# EAGLE design EEZ AUX PS r5B6a (EAGLE 6.1)
Assembly variants: Farnell, TME

## Sheet 1 of 2
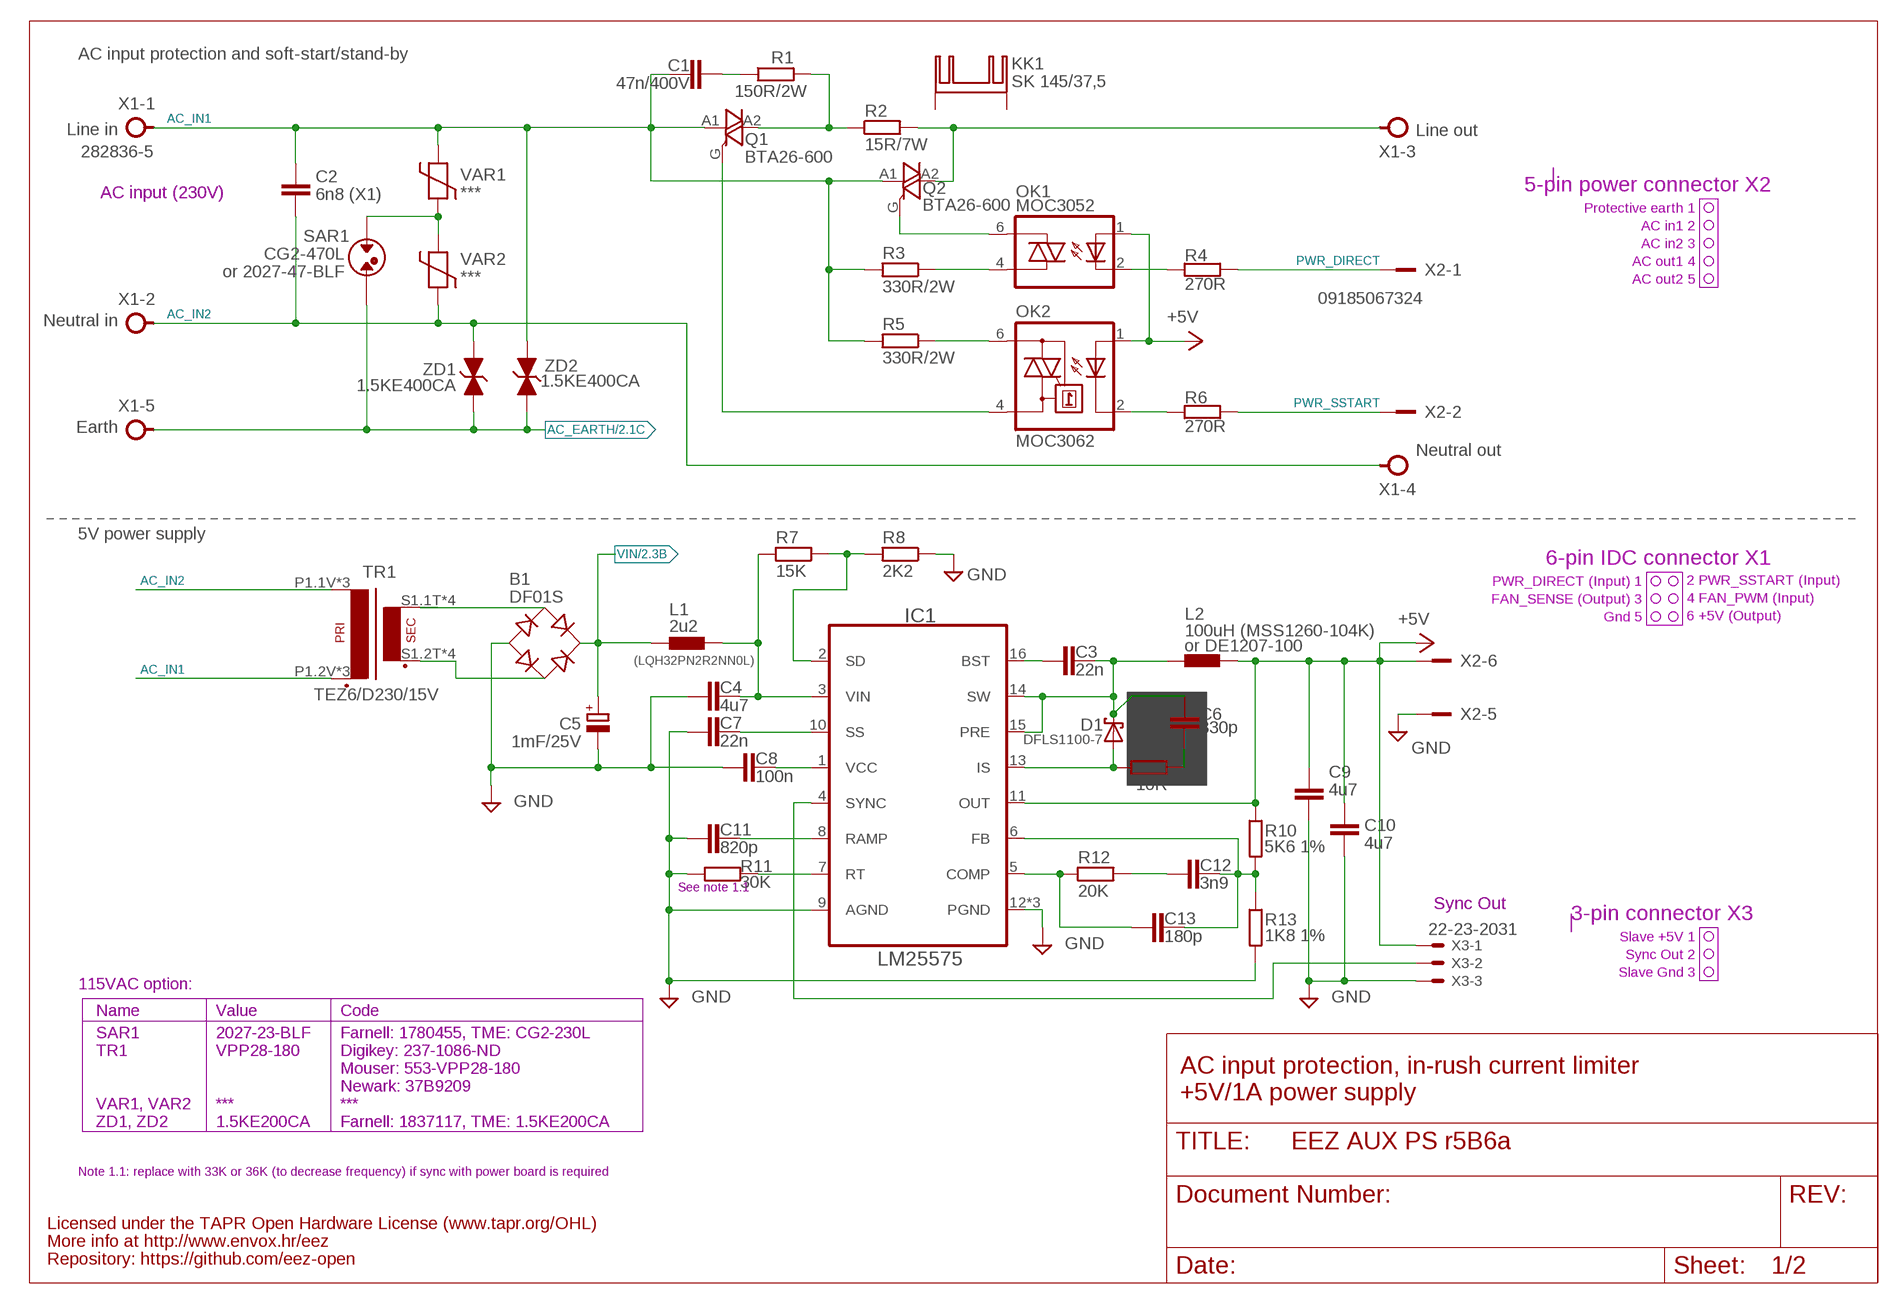
[diagram p0: schematic, sheet 1]

### Parts
B1  DF01S  [DFS]
C1  47n/400V  C-EU075-052X106  [C075-052X106]
C2  6n8 (X1)  C-EU102-064X133  [C102-064X133]
C3  22n  C-EUC0805  [C0805]
C4  4u7  C-EUC1210  [C1210]
C5  1mF/25V  ECAP5G_10.5MM  [ECAP5/10.5]
C6  330p  C-EUC0805  [C0805]
C7  22n  C-EUC0805  [C0805]
C8  100n  C-EUC0805  [C0805]
C9  4u7  C-EUC1210  [C1210]
C10  4u7  C-EUC1210  [C1210]
C11  820p  C-EUC0805  [C0805]
C12  3n9  C-EUC0805  [C0805]
C13  180p  C-EUC0805  [C0805]
D1  DFLS1100-7  SCHOTTKYSOD123  [SOD123]
IC1  LM25575  LM(2)5575  [SOP65P640X110-17N_HOLE]
KK1  SK 145/37,5  SK145  [SK145]
L1  2u2  L1210  [L1210]
L2  100uH (MSS1260-104K)  COILCRAFT_MSS1278  [MSS1278]
OK1  MOC3052  MOC305X  [DIL6-SMD]
OK2  MOC3062  MOC3033S  [DIL6-SMD]
Q1  BTA26-600  BTA26-V  [TOP3S-1]
Q2  BTA26-600  BTA26-V  [TOP3S-1]
R1  150R/2W  R-EU_R2512  [R2512]
R2  15R/7W  R_EU7W  [R_0913]
R3  330R/2W  R-EU_R2512  [R2512]
R4  270R  R-EU_R0805  [R0805]
R5  330R/2W  R-EU_R2512  [R2512]
R6  270R  R-EU_R0805  [R0805]
R7  15K  R-EU_R0805  [R0805]
R8  2K2  R-EU_R0805  [R0805]
R9  10R  R-EU_R1206  [R1206]
R10  5K6 1%  R-EU_R0805  [R0805]
R11  30K  R-EU_R0805  [R0805]
R12  20K  R-EU_R0805  [R0805]
R13  1K8 1%  R-EU_R0805  [R0805]
SAR1  CG2-470L  SAR  [SAR]
TR1  TEZ6/D230/15V  PCB_TRAFO6VA_TEZ+VPP  [PCB_TRAFO6VA_TEZ+VPP]
VAR1  ***  VARISTOR  [VARISTOR]
VAR2  ***  VARISTOR  [VARISTOR]
X1  282836-5  TBLOCK5.0_5A  [TBLOCK5.0_5]
X2  09185067324  IDC-6PIN  [IDC-6PIN]
X3  22-23-2031  [22-23-2031]
ZD1  1.5KE400CA  1.5KE-BIDIR  [DO201-BIDIR]
ZD2  1.5KE400CA  1.5KE-BIDIR  [DO201-BIDIR]

### Nets
+5V: C9.1 C10.1 IC1.11(OUT) L2.2 OK1.1(A) OK2.1(A) R10.1 X2.6 X3.1 ; also sheet 2
AC_EARTH: SAR1.P$2 X1.5 ZD1.C ZD2.C ; also sheet 2
AC_IN1: C1.2 C2.1 Q1.A1 Q2.A1 R3.2 R5.2 TR1.P1.2V(P2) TR1.P2.2V(P2) TR1.P2_TEZ(P2) VAR1.P$2 X1.1 ZD2.A
AC_IN2: C2.2 TR1.P1.1V(P1) TR1.P1_TEZ(P1) TR1.P2.1V(P1) VAR2.P$1 X1.2 X1.4 ZD1.A
DC_PREG1: C4.1 IC1.3(VIN) L1.2 R7.2
GND [gnd]: B1.- C4.2 C5.- C7.2 C8.1 C9.2 C10.2 C11.1 IC1.9(AGND) IC1.12(PGND) IC1.TP2(PGND) IC1.TP(PGND) R8.1 R11.2 R13.2 X2.5 X3.3 ; also sheet 2
IS: D1.A IC1.13(IS) R9.1
N$1: C6.2 R9.2
N$2: OK1.6(A2) Q2.G
N$3: OK1.4(A1) R3.1
N$4: OK2.4(A1) Q1.G
N$5: OK1.2(C) R4.1
N$6: OK2.2(C) R6.1
N$7: OK2.6(A2) R5.1
N$8: Q2.A2 R2.2 X1.3
N$9: B1.AC1 TR1.S1.1T(S1) TR1.S1.1V(S1) TR1.S2.1T(S1) TR1.S2.1V(S1)
N$13: IC1.4(SYNC) X3.2
N$15: C1.1 R1.1
N$20: B1.AC2 TR1.S1.2T(S2) TR1.S1.2V(S2) TR1.S2.2T(S2) TR1.S2.2V(S2)
N$25: Q1.A2 R1.2 R2.1
N$77: C12.2 R12.2
N$114: SAR1.P$1 VAR1.P$1 VAR2.P$2
N$128: C12.1 C13.1 IC1.6(FB) R10.2 R13.1
N$131: C3.2 IC1.16(BST)
N$135: C13.2 IC1.5(COMP) R12.1
N$165: IC1.7(RT) R11.1
N$166: C8.2 IC1.1(VCC)
N$167: C11.2 IC1.8(RAMP)
N$168: C7.1 IC1.10(SS)
N$180: IC1.2(SD) R7.1 R8.2
PWR_DIRECT: R4.2 X2.1
PWR_SSTART: R6.2 X2.2
SW: C3.1 C6.1 D1.C IC1.14(SW) IC1.15(PRE) L2.1
VIN: B1.+ C5.+ L1.1 ; also sheet 2
Unconnected: KK1.1(K) KK1.2(K)

### Notes on the sheet
- AC input protection and soft-start/stand-by
- Line in
- Line out
- 5-pin power connector X2
- AC input (230V)
- Protective earth 1
- AC in1 2
- AC in2 3
- AC out1 4
- or 2027-47-BLF
- AC out2 5
- Neutral in
- Earth
- Neutral out
- 5V power supply
- 6-pin IDC connector X1
- PWR_DIRECT (Input) 1
- 2 PWR_SSTART (Input)
- FAN_SENSE (Output) 3
- 4 FAN_PWM (Input)
- Gnd 5
- 6 +5V (Output)
- or DE1207-100
- (LQH32PN2R2NN0L)
- See note 1.1
- Sync Out | 3-pin connector X3
- Slave +5V 1
- Sync Out 2
- Slave Gnd 3
- 115VAC option:
- Name | Value | Code
- SAR1 | 2027-23-BLF | Farnell: 1780455, TME: CG2-230L
- TR1 | VPP28-180 | Digikey: 237-1086-ND
- Mouser: 553-VPP28-180 | AC input protection, in-rush current limiter
- Newark: 37B9209
- +5V/1A power supply
- VAR1, VAR2 | *** | ***
- ZD1, ZD2 | 1.5KE200CA | Farnell: 1837117, TME: 1.5KE200CA
- Note 1.1: replace with 33K or 36K (to decrease frequency) if sync with power board is required
- Licensed under the TAPR Open Hardware License (www.tapr.org/OHL)
- More info at http://www.envox.hr/eez
- Repository: https://github.com/eez-open

## Sheet 2 of 2
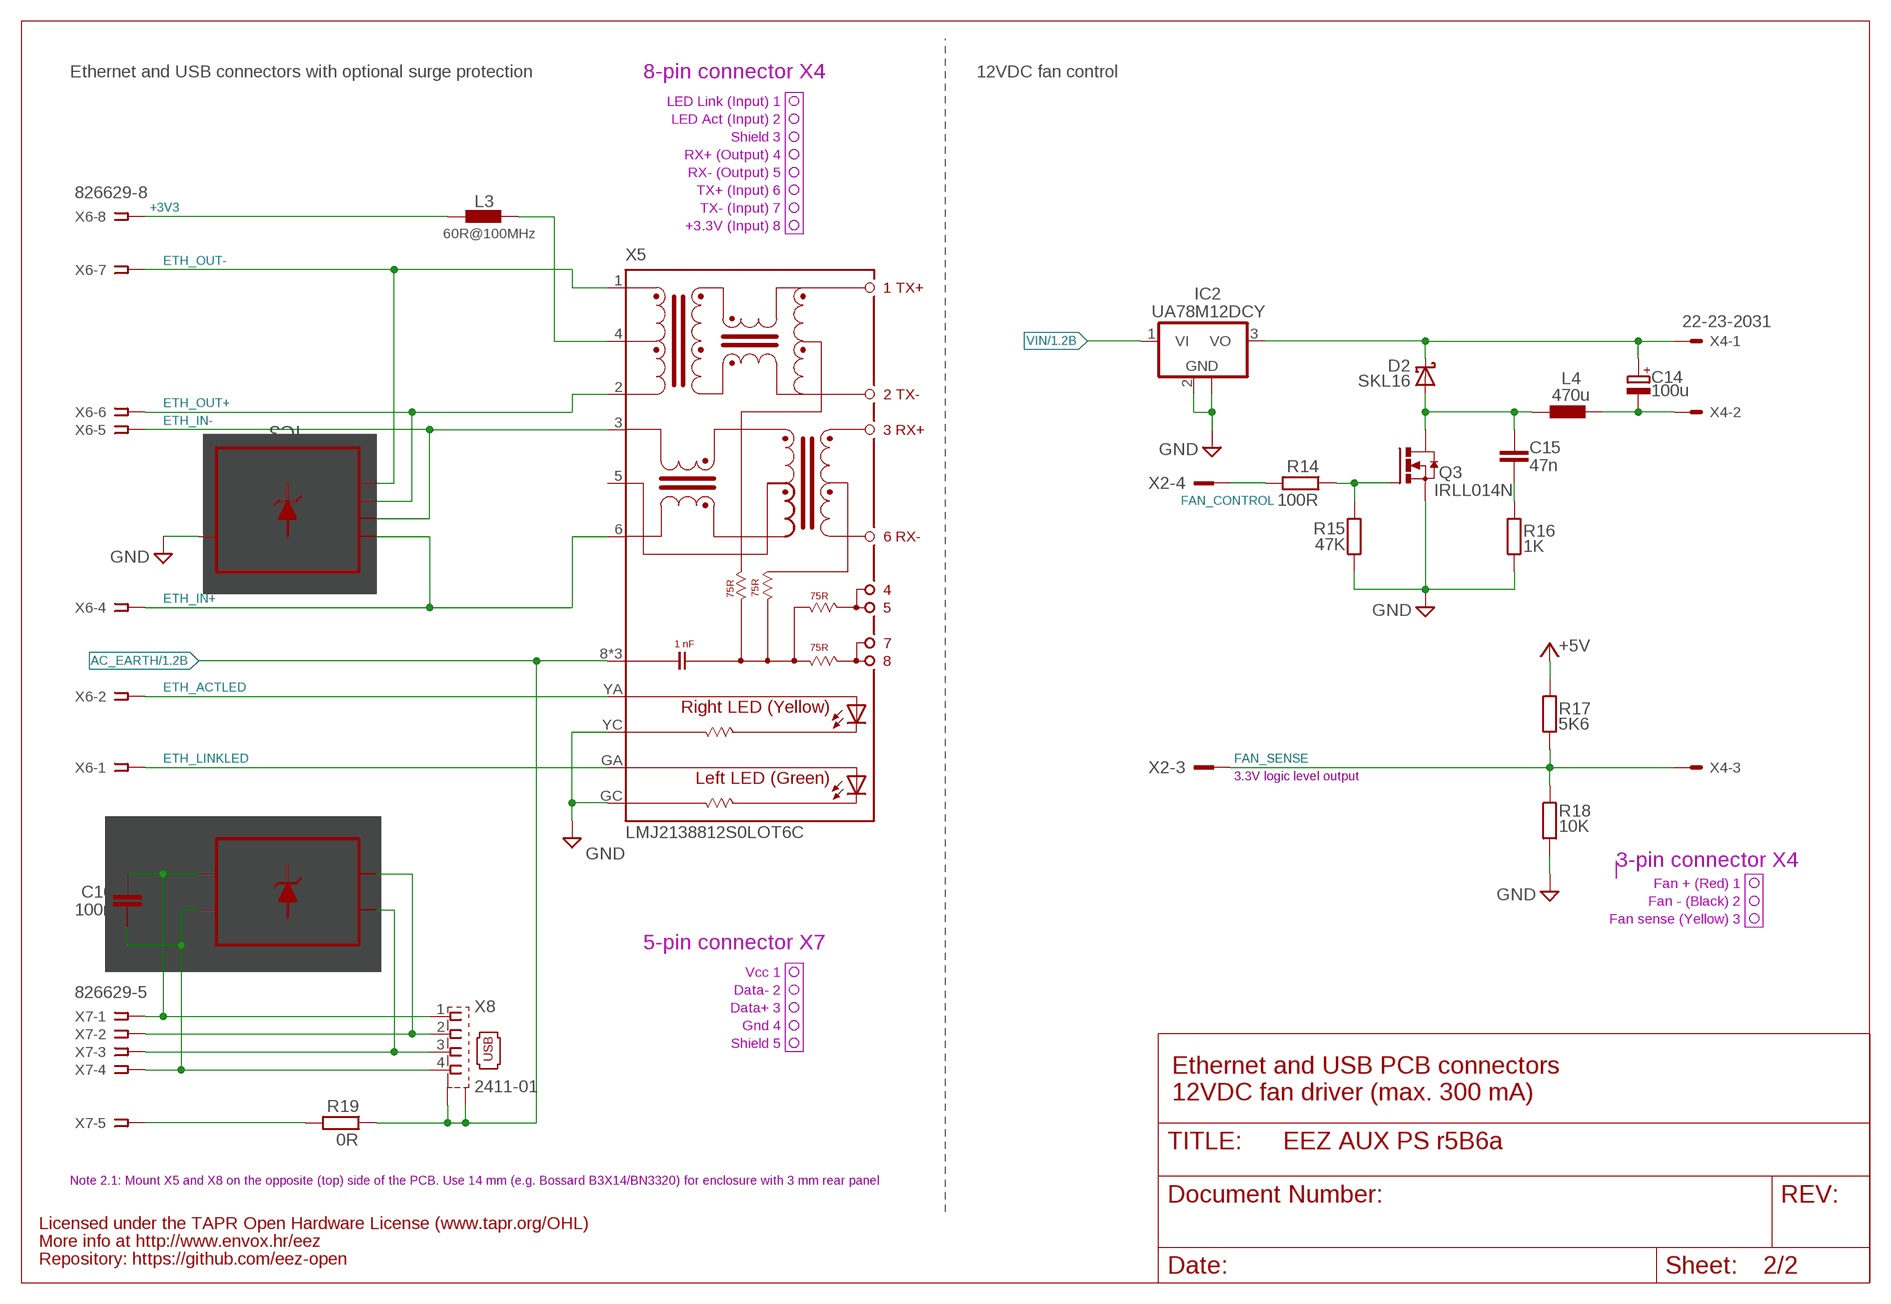
[diagram p1: schematic, sheet 2]

### Parts
C14  100u  ECAPPANASONIC_H  [CAPAE660X610N]
C15  47n  C-EUC0805  [C0805]
C16  100n  C-EUC0805  [C0805]
D2  SKL16  SCHOTTKYSOD123  [SOD123]
IC2  UA78M12DCY  UA78MDCY  [SOT230P700X180-4N]
IC3  TPD4E002DRLR  [SOT50P280X60-5N]
IC4  TPD2E001DZDR  [SOP192P292X122-4N]
L3  60R@100MHz  FERRITE_BEAD0603  [BEAD0603]
L4  470u  DE0704  [DE0704]
Q3  IRLL014N  N-HEXFET-2D_SOT232-IRLL014N  [SOT223]
R14  100R  R-EU_R0805  [R0805]
R15  47K  R-EU_R0805  [R0805]
R16  1K  R-EU_R0805  [R0805]
R17  5K6  R-EU_R0805  [R0805]
R18  10K  R-EU_R0805  [R0805]
R19  0R  R-EU_R0805  [R0805]
X4  22-23-2031  [22-23-2031]
X5  LMJ2138812S0LOT6C  RJ45-VERT  [RJ45-VERT]
X6  826629-8  SSW-108-02-S-S  [SSW-108-02-S-S]
X7  826629-5  SSW-105-02-S-S  [SSW-105-02-S-S]
X8  2411-01  KUSBVX-BS1N  [KUSBVX-BS1N]

### Nets
+3V3: L3.P$2 X6.8
+5V: R17.1 ; also sheet 1
AC_EARTH: R19.1 X5.8(SH) X5.SH1(SH) X5.SH2(SH) X8.M1(S1) X8.M2(S2) ; also sheet 1
ETH_ACTLED: X5.YA(YELLOW_A) X6.2
ETH_IN+: IC3.5(IO4) X5.6(RD-) X6.4
ETH_IN-: IC3.4(IO3) X5.3(RD+) X6.5
ETH_LINKLED: X5.GA(GREEN-A) X6.1
ETH_OUT+: IC3.3(IO2) X5.2(TD-) X6.6
ETH_OUT-: IC3.1(IO1) X5.1(TD+) X6.7
FAN_CONTROL: R14.2 X2.4
FAN_OUT: C15.2 D2.A L4.2 Q3.2(D) Q3.4(D)
FAN_SENSE: R17.2 R18.1 X2.3 X4.3
GND [gnd]: IC2.2(GND) IC2.4(GND) IC3.2(GND) Q3.3(S) R15.1 R16.1 R18.2 X5.GC(GREEN-C) X5.YC(YELLOW-C) ; also sheet 1
N$11: C16.2 IC4.4(VCC) X7.1 X8.1
N$12: C15.1 R16.2
N$14: R19.2 X7.5
N$17: Q3.1(G) R14.1 R15.2
N$18: IC4.2(IO1) X7.2 X8.2
N$19: C14.1(+) D2.C IC2.3(VO) X4.1
N$21: C14.2(-) L4.1 X4.2
N$22: IC4.3(IO2) X7.3 X8.3
N$23: C16.1 IC4.1(GND) X7.4 X8.4
N$125: L3.P$1 X5.4(CT)
VIN: IC2.1(VI) ; also sheet 1
Unconnected: X5.5(CR) X6.3

### Notes on the sheet
- Ethernet and USB connectors with optional surge protection | 12VDC fan control
- 8-pin connector X4
- LED Link (Input) 1
- LED Act (Input) 2
- Shield 3
- RX+ (Output) 4
- RX- (Output) 5
- TX+ (Input) 6
- TX- (Input) 7
- +3.3V (Input) 8
- 3.3V logic level output
- 3-pin connector X4
- Fan + (Red) 1
- Fan - (Black) 2
- Fan sense (Yellow) 3
- 5-pin connector X7
- Vcc 1
- Data- 2
- Data+ 3
- Gnd 4
- Shield 5
- Ethernet and USB PCB connectors
- 12VDC fan driver (max. 300 mA)
- Note 2.1: Mount X5 and X8 on the opposite (top) side of the PCB. Use 14 mm (e.g. Bossard B3X14/BN3320) for enclosure with 3 mm rear panel
- Licensed under the TAPR Open Hardware License (www.tapr.org/OHL)
- More info at http://www.envox.hr/eez
- Repository: https://github.com/eez-open

## Library data of the parts
B1 = rectifier:DF*S: Surface Mount Glass Passivated Bridge Rectifiers Source: Source: Comchip Bridge Rectifiers DF005S-G thru DF10S-G.pdf
C1-C4 C6-C13 C15 C16 = rcl:C-EU: CAPACITOR, European symbol
C5 C14 = EEZ_Lib1:ECAP
D1 D2 = EEZ_Lib1:SCHOTTKY
IC1 = EEZ_Lib1:LM(2)5575: Simple Switcher® 42V, 1.5A Step-Down Switching Regulator
IC2 = EEZ_Lib1:UA78M*
IC3 = EEZ_Lib1:TPD4E002: Low-Capacitance 4-Channel +/-15-kV ESD Protection Array for High-Speed Data Interfaces
IC4 = EEZ_Lib1:TPD2E001: Low-Capacitance 2-Channel +/-15 kV ESD-Protection Array for High-Speed Data Interfaces
KK1 = EEZ_Lib1:SK145: FISCHER ELEKTRONIK SK 145/37,5 STS-220 Heat Sink, TO-220, TO-218, TO-220, TO-247, TO-248, 12 °C/W, 29 mm, 12 mm
L1 = EEZ_Lib1:L1210
L2 = EEZ_Lib1:COILCRAFT_MSS1278: Coilcraft SMT Power Inductors – MSS1278
L3 = MyLib6:FERRITE_BEAD: FAIR-RITE - 2506033007Y3 - FERRITE BEAD, 0.04OHM, 3A, 0603 Farnell: 2112873
L4 = EEZ_Lib1:DE0704: Ferrocore SMD power coil 7.3 x 7.3 mm
OK1 = EEZ_Lib1:MOC305X: 6-pin DIP Random-phase Optoisolators Triac Drivers (600V Peak)
OK2 = optocoupler:MOC30*: 6-Pin DIP Zero-Cross Optoisolators Triac Driver Output (250/400 Volt Peak) Source: http://www.fairchildsemi.com/ds/MO/MOC3043-M.pdf; MF: FAIRCHILD SEMICONDUCTOR; MPN: MOC3033S-M; OC_FARNELL: unknown; OC_NEWARK: 05C2878
Q1 Q2 = triac:BTA26: 25A TRIAC Source: http://www.st.com/stonline/products/literature/ds/7470.pdf
Q3 = transistor-power:N-HEXFET-2D_?-*: HEXFET® Power MOSFET 2 Drain connects http://www.irf.com/product-info/datasheets/data/irll014n.pdf
R1 R3-R19 = rcl:R-EU_: RESISTOR, European symbol
R2 = EEZ_Lib1:R_EU: RESISTOR - European symbol
SAR1 = EEZ_Lib1:SAR: EPCOS surge arrester EF470X Farnell: 1886596
TR1 = EEZ_Lib1:PCB_TRAFO6VA_TEZ+VPP: Breve Tufvassons TEZ 6/D or Triad Magnetics VPP; DIGIKEY: 237-1086-ND; MOUSER: 553-VPP28-180; NEWARK: 37B9209; TME: TEZ6/D/15-15V
VAR1 VAR2 = EEZ_Lib1:VARISTOR: EPCOS - B72220S0251K101 - VARISTOR, 140J, 250VAC Farnell: 1004357
X1 = EEZ_Lib1:TBLOCK5.0_5A
X2 = EEZ_Lib1:IDC-6PIN: 6-pin IDC socket male, straight; FARNELL: 1096984; TME: 09185067324
X3 X4 = con-molex:22-23-2031: .100" (2.54mm) Center Header - 3 Pin; MF: MOLEX; MPN: 22-23-2031; OC_FARNELL: 1462950; OC_NEWARK: 30C0862
X5 = EEZ_Lib1:RJ45-VERT: AMPHENOL LMJ2138812S0LOT6C Socket; RJ45; PIN:8; vertical, shielded, with LED and trafo; TME: LMJ2138812S0LOT6C
X6 = con-samtec:SSW-108-02-S-S: THROUGH-HOLE .025" SQ POST SOCKET Source: Samtec SSW.pdf; MPN: SSW-108-02-S-S; OC_FARNELL: unknown; OC_NEWARK: 11P9448
X7 = con-samtec:SSW-105-02-S-S: THROUGH-HOLE .025" SQ POST SOCKET Source: Samtec SSW.pdf; MPN: SSW-105-02-S-S; OC_FARNELL: unknown; OC_NEWARK: 11P9399
X8 = con-kycon:KUSBVX-BS1N: USB B-type Receptacle Vertical, 4 Position, Through Hole Source: Sibalco Kycon KUSBVX-BS1N-xxx.pdf
ZD1 ZD2 = EEZ_Lib1:1.5KE-BIDIR

## Net classes
0 default: width 0.254 mm, drill 0.584 mm, clearance 0.254 mm
1 power: width 0.254 mm, drill 0.584 mm, clearance 0.254 mm
2 gnd: width 0.254 mm, drill 0.584 mm, clearance 0.254 mm

## Board
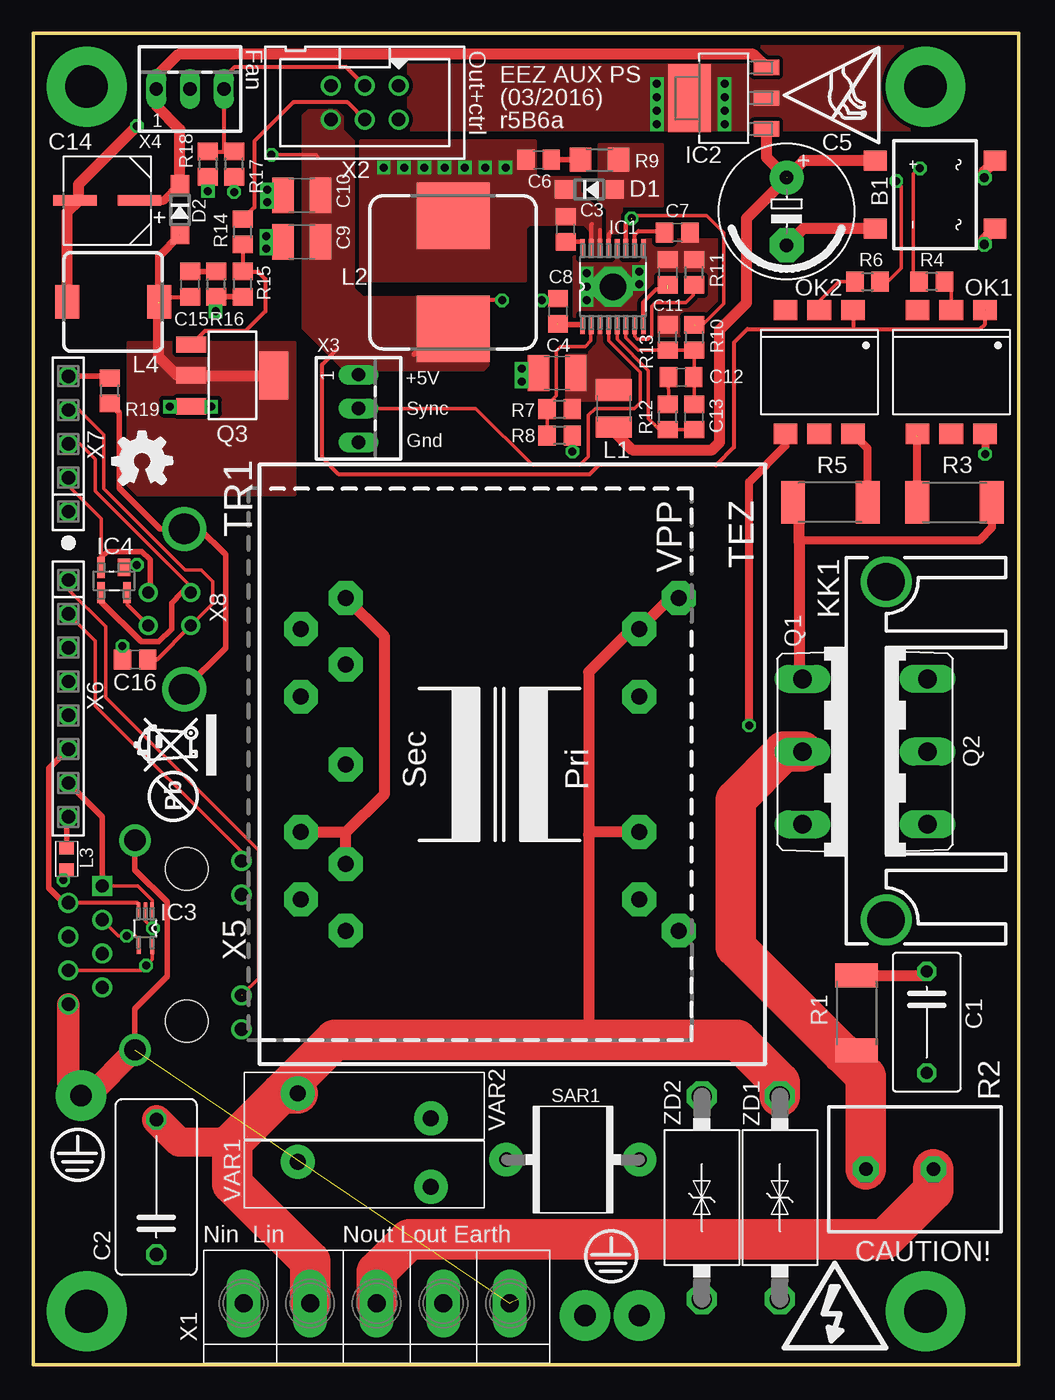
[diagram p2: board, top side]
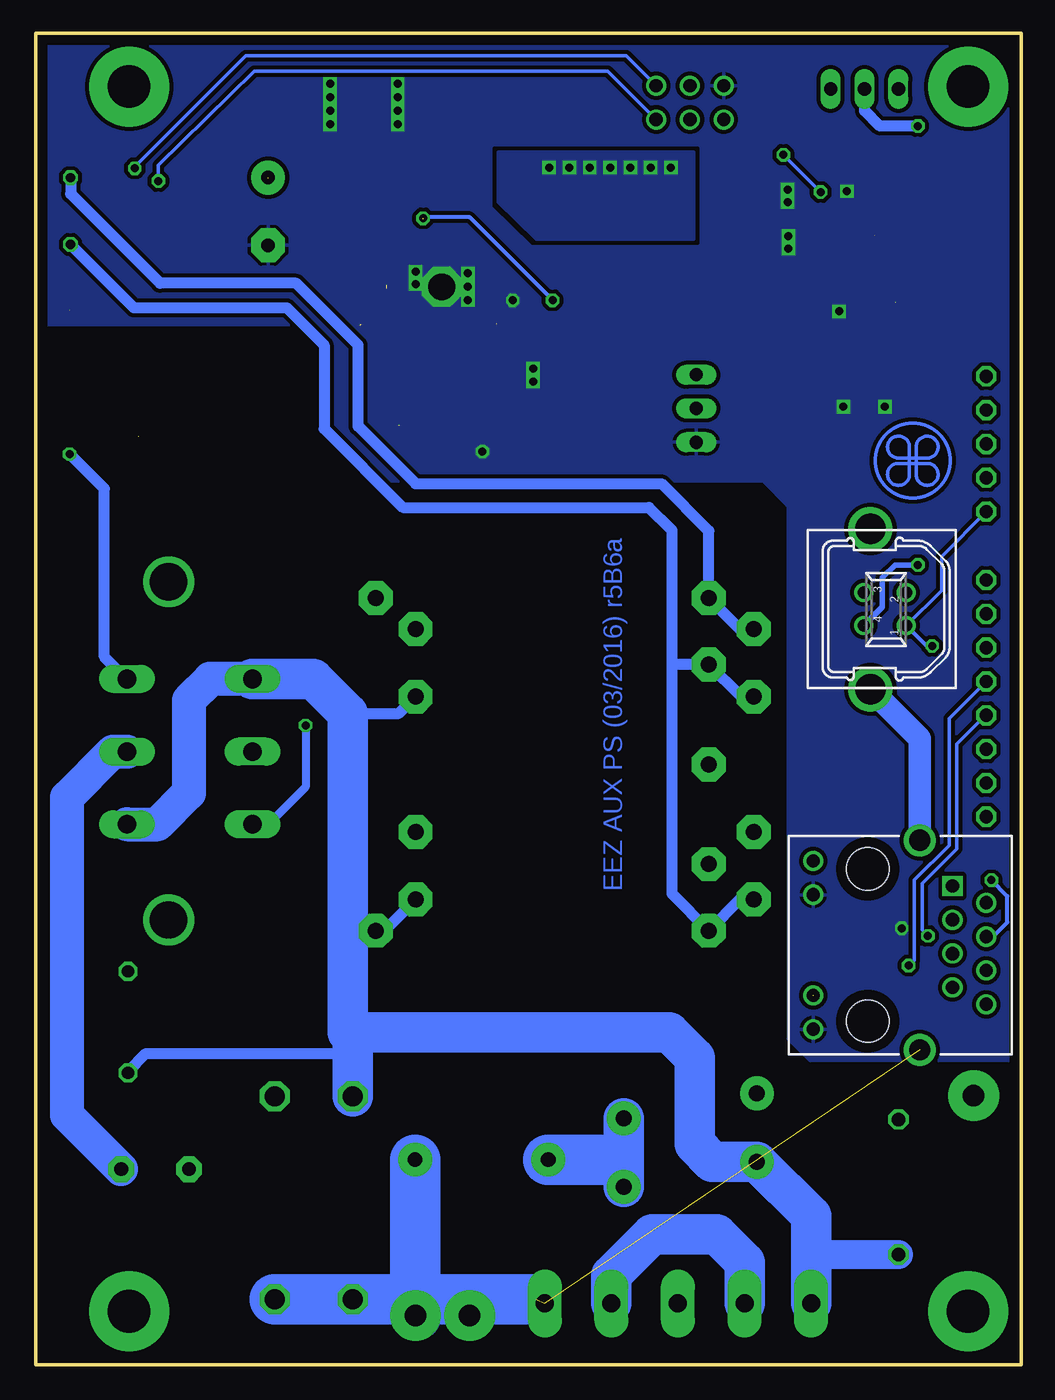
[diagram p3: board, bottom side, seen from below]

Size 74 x 100 mm. Coordinates in mm from the lower left corner, seen from the top.
Outline: 0,0 0,100 74,100 74,0 0,0
Copper layers (1+5*16): Top 0.035mm / dielectric 0.75mm / Route5 0.035mm / dielectric 0.75mm / Bottom 0.035mm
Design rules: minimum track width 10mil, minimum drill 0.5mm, track to track 8mil, track to pad 8mil, pad to pad 8mil, via to via 8mil, smd to smd 8mil, copper to edge 30mil, drill to drill 8mil, minimum pad ring 10mil, minimum via ring 8mil, stop-mask expansion 4mil, vias tented up to drill 25mil, thermal gap 10mil

### Footprints (pad centres in the part's own frame; a part is rotated, then mirrored left to right if it is on the bottom)
DFS = smd 1.5 x 1.7: + -2.55,-4.5; - 2.55,-4.5; AC1 -2.55,4.5; AC2 2.55,4.5
C075-052X106 = drill 0.914 octagon: 1 -3.81,0; 2 3.81,0
C102-064X133 = drill 1.016 octagon: 1 -5.08,0; 2 5.08,0
C0805 = smd 1.3 x 1.5: 1 -0.95,0; 2 0.95,0
C1210 = smd 1.6 x 2.7: 1 -1.4,0; 2 1.4,0
ECAP5/10.5 = drill 1.016 pad 2.54: + -2.54,0 | drill 1.016 pad 2.54 octagon: - 2.54,0
CAPAE660X610N = smd 3.251 x 0.762: 1 -2.413,0; 2 2.413,0
SOD123 = smd 1.4 x 1.4: A 1.9,0; C -1.9,0
SOP65P640X110-17N_HOLE = smd 1.422 x 0.356: 1 -2.845,2.286; 2 -2.845,1.626; 3 -2.845,0.965; 4 -2.845,0.33; 5 -2.845,-0.33; 6 -2.845,-0.965; 7 -2.845,-1.626; 8 -2.845,-2.286; 9 2.845,-2.286; 10 2.845,-1.626; 11 2.845,-0.965; 12 2.845,-0.33; 13 2.845,0.33; 14 2.845,0.965; 15 2.845,1.626; 16 2.845,2.286 | smd 2.032 x 2.032: TP 0,0 | drill 2 octagon: TP2 0,0
SOT230P700X180-4N = smd 1.905 x 1.143: 1 -3.2,2.311; 2 -3.2,0; 3 -3.2,-2.311 | smd 3.175 x 5.08: 4 2.565,0
SOT50P280X60-5N = smd 1.118 x 0.254: 1 -1.372,0.508; 2 -1.372,0; 3 -1.372,-0.508 | smd 1.118 x 0.305: 4 1.372,-0.508; 5 1.372,0.508
SOP192P292X122-4N = smd 0.94 x 1.321: 1 -0.762,-1.016 | smd 0.559 x 1.575: 2 0.965,-1.016; 3 0.965,0.889; 4 -0.965,0.889
SK145 = drill 2.8: 1 -12.7,0; 2 12.7,0
L1210 = smd 1.6 x 2.7: 1 -1.4,0; 2 1.4,0
MSS1278 = smd 5.5 x 5: 1 0,4.25; 2 0,-4.25
BEAD0603 = smd 1 x 1.1: P$1 -0.85,0; P$2 0.85,0
DE0704 = smd 2.5 x 1.8: 1 0,3.45; 2 0,-3.45
DIL6-SMD = smd 1.78 x 1.52: 1 -2.54,-4.645; 2 0,-4.645; 3 2.54,-4.645; 4 2.54,4.645; 5 0,4.645; 6 -2.54,4.645
TOP3S-1 = drill 1.397 long: A1 -5.461,-3.175; A2 0,-3.175; G 5.461,-3.175
SOT223 = smd 1.219 x 2.235: 1 -2.311,-3.099; 2 0,-3.099; 3 2.311,-3.099 | smd 3.6 x 2.2: 4 0,3.099
R2512 = smd 1.8 x 3.2: 1 -2.8,0; 2 2.8,0
R_0913 = drill 1.016 pad 1.93 octagon: 1 -3.556,0; 2 1.524,0
R0805 = smd 1.3 x 1.5: 1 -0.95,0; 2 0.95,0
R1206 = smd 1.6 x 1.803: 1 -1.422,0; 2 1.422,0
SAR = drill 1.1 pad 2.54: P$1 0,0; P$2 10,0
PCB_TRAFO6VA_TEZ+VPP = drill 1.2 pad 2.54 octagon: NC -12.5,0; P1.1V 9.525,10.16; P1.2V 9.525,5.08; P1_TEZ 12.5,12.5; P2.1V 9.525,-5.08; P2.2V 9.525,-10.16; P2_TEZ 12.5,-12.5; S1.1T -12.5,12.5; S1.1V -15.875,10.16; S1.2T -12.5,7.5; S1.2V -15.875,5.08; S2.1T -12.5,-7.5; S2.1V -15.875,-5.08; S2.2T -12.5,-12.5; S2.2V -15.875,-10.16
VARISTOR = drill 1.2 pad 2.54: P$1 -5,0.95; P$2 5,-0.95
TBLOCK5.0_5 = drill 1.35 pad 2.54 long: 1 0,0; 2 0,-5; 3 0,-10; 4 0,-15; 5 0,-20
IDC-6PIN = drill 1 pad 1.422: 1 -2.54,-1.27; 2 -2.54,1.27; 3 0,-1.27; 4 0,1.27; 5 2.54,-1.27; 6 2.54,1.27
22-23-2031 = drill 1 long: 1 -2.54,0; 2 0,0; 3 2.54,0
RJ45-VERT = drill 1 square: 1 4.445,-5.08 | drill 1: 2 3.175,-7.62; 3 1.905,-5.08; 4 0.635,-7.62; 5 -0.635,-5.08; 6 -1.905,-7.62; 7 -3.175,-5.08; 8 -4.445,-7.62; GA -3.785,5.38; GC -6.325,5.38; YA 6.325,5.38; YC 3.785,5.38 | drill 1.6: SH1 7.875,-2.62; SH2 -7.875,-2.62 | hole 3.2: -5.715,1.27; 5.715,1.27
SSW-108-02-S-S = drill 1 pad 1.5 octagon: 1 -8.89,0; 2 -6.35,0; 3 -3.81,0; 4 -1.27,0; 5 1.27,0; 6 3.81,0; 7 6.35,0; 8 8.89,0
SSW-105-02-S-S = drill 1 pad 1.5 octagon: 1 -5.08,0; 2 -2.54,0; 3 0,0; 4 2.54,0; 5 5.08,0
KUSBVX-BS1N = drill 0.9 pad 1.422: 1 1.25,2.7; 2 -1.25,2.7; 3 -1.25,-0.5; 4 1.25,-0.5 | drill 2.3 pad 2.7: M1 -6.02,0; M2 6.02,0
DO201-BIDIR = drill 1.499 octagon: A 7.62,0; C -7.62,0

### Placement (x,y rotation side)
B1  67.72,87.88 270 top
C1  67.09,25.72 270 top
C2  9.24,13.34 90 top
C3  39.97,85.28 270 top
C4  39.34,74.49 180 top
C5  56.57,86.62 270 top
C6  37.94,90.49 0 top
C7  48.35,85.03 0 top
C8  39.4,79.12 270 top
C9  20.16,84.33 180 top
C10  20.16,87.82 180 top
C11  47.66,82.04 270 top
C12  48.65,74.17 180 top
C13  49.62,71.18 270 top
C14  5.55,87.44 180 top
C15  11.78,81.15 270 top
C16  7.65,52.96 180 top
D1  41.75,88.27 0 top
D2  11.02,86.74 270 top
EEZ_SIGNATURE  SIGNATURESMALL  [SIGNATURE_5MM]  8.16,67.89 180 top
IC1  43.53,80.96 90 top
IC2  51.85,95.12 180 top
IC3  8.41,32.77 270 top
IC4  6.06,58.86 180 top
KK1  64.04,46.1 270 top
L1  43.59,71.82 90 top
L2  31.53,82.04 0 top
L3  2.51,37.97 90 top
L4  6,79.82 90 top
OK1  68.93,74.55 180 top
OK2  59.02,74.55 180 top
Q1  60.93,46.04 270 top
Q2  63.97,46.04 90 top
Q3  14.95,74.3 270 top
R1  61.82,26.42 270 top
R2  66.07,14.67 0 top
R3  69.18,64.77 0 top
R4  67.47,81.34 180 top
R5  59.85,64.77 180 top
R6  62.64,81.34 0 top
R7  39.53,71.75 0 top
R8  39.53,69.79 180 top
R9  42.51,90.49 180 top
R10  49.62,77.15 270 top
R11  49.62,82.04 90 top
R12  47.66,71.18 90 top
R13  47.66,77.15 90 top
R14  15.71,85.09 90 top
R15  15.71,81.15 90 top
R16  13.75,81.15 90 top
R17  15.08,90.17 90 top
R18  13.11,90.17 270 top
R19  5.74,73.15 90 top
SAR1  35.53,15.39 0 top
TR1  35.97,45.09 0 top
U$2  [RECYCLE_BIN1/8]  13.74,44.26 90 top
U$3  [PB_SMALL]  10.51,42.68 90 top
U$4  [ESD_SYMBOL]  63.49,91.79 90 top
VAR1  24.86,14.29 180 top
VAR2  24.86,19.43 0 top
X1  15.79,4.59 90 top
X2  24.89,94.79 180 top
X3  24.41,71.82 270 top
X4  11.78,95.82 0 top
X5  10.26,31.51 90 bottom
X6  2.63,50.04 270 top
X7  2.63,69.15 90 top
X8  11.34,56.75 270 bottom
ZD1  56.06,12.54 90 top
ZD2  50.21,12.54 90 top

### Tracks (layer width: path | path; a pad name or v marks a point on that pad's centre or on a via)
+3V3
  Top 0.406: L3.P$2 2.51,41.02 X6.8
+5V  (via drill 0.6)  (3 unrouted)
  Top 0.254: 44.92,86.04 45.18,86.3 50.58,86.3 51.85,85.03 51.85,79.69 50.26,78.11 49.75,78.11 49.69,78.04 | R17.1 v15.08,88.08 | v17.87,90.87 21.24,90.87 21.37,90.74
  Top 0.305: 29.11,76.26 29.05,76.33 29.56,76.33 30.95,77.72 | 30.95,77.72 31.02,77.79 | L2.2 30.89,77.79 30.95,77.72 | v35.21,79.95 33.24,79.95 31.08,77.79 | 22.76,76.2 21.68,75.12 21.68,68.14 22.95,66.86 41.75,66.86 42.45,67.56 51.27,67.56 52.61,68.9 52.61,76.77 53.62,77.79 61.56,77.79 | 61.56,77.79 71.09,77.79 71.47,78.17 OK1.1 | OK2.1 61.56,77.79
  Top 0.356: IC1.11 44.49,85.67 v44.92,86.11
  Top 0.406: 28.61,75.88 29.05,76.33
  Bottom 0.254: v15.08,88.08 v17.87,90.87
  Bottom 0.305: v35.21,79.95 41.43,86.17 44.86,86.17 v44.92,86.11
  pour Top (isolate 0.305, no thermals): 20.67,94.17 22.76,94.17 23.21,93.73 23.21,92.71 24.03,91.88 24.03,80.84 24.73,80.14 33.75,80.14 34.13,79.76 34.13,75.06 33.81,74.74 23.4,74.74 20.29,77.85 20.29,93.79
AC_EARTH  (via drill 1.6 pad 3.81)  (2 unrouted)
  Top 0.406: R19.1 6.44,71.5 6.44,65.85 9.53,62.77 X8.M1 12.51,62.77 14.45,60.83 14.45,53.83 X8.M2 | X5.SH1 7.64,37.16 10.06,34.73 10.06,29.15 7.64,26.72 X5.SH2
  Top 1.676: X5.SH2 4.2,20.19 v3.59,20.19 2.64,21.14 X5.8
  Bottom 1.676: X5.SH1 7.64,47.02 X8.M2
  Bottom 3.81: ZD1.C ZD2.C 45.62,4.92 | 45.62,4.92 45.43,4.92 | 45.43,4.92 41.43,4.92 | 41.43,4.92 36.42,4.92 36.42,4.89 | v45.5,3.68 45.43,3.68 45.43,4.92 | v41.43,3.68 41.43,4.92 | SAR1.P$2 45.53,5.01 45.62,4.92
AC_IN1
  Top 0.61: R3.2 71.98,62.87 71.02,61.91 57.62,61.91 57.5,61.78
  Top 0.813: R5.2 57.5,64.32 57.5,61.78 57.5,51.75 Q1.A1
  Bottom 0.813: 50.47,45.34 50.6,45.21 | 50.6,32.51 50.53,32.59 TR1.P2_TEZ 47.84,32.59 TR1.P2.2V | 50.6,48.92 46.74,48.92 TR1.P1.2V | C1.2 67.09,22.04 65.75,23.37 50.85,23.37 50.6,24.96
  Bottom 2.184: C2.1 15.73,8.26 15.79,8.32
  Bottom 2.54: Q1.A1 60.93,51.5 62.51,49.91 62.51,42.93 64.86,40.58 Q2.A1
  Bottom 3.048: Q1.A1 53.18,51.5 50.6,48.92 50.6,45.21 50.6,32.51 50.6,25.34 | 50.6,25.34 50.6,24.96 26.45,24.96 | X1.1 15.79,8.32 15.79,11.17 VAR1.P$2 23.2,15.24 24.54,16.57 24.54,23.05 26.45,24.96 | ZD2.A 50.21,24.94 50.6,25.34 | 26.45,24.96 26.45,24.89
AC_IN2
  Top 0.813: TR1.P1_TEZ 47.84,57.59 TR1.P1.1V 44.95,55.24 41.71,52.01 41.71,39.81 | 41.71,39.81 41.71,24.47 41.62,24.38 | TR1.P2.1V 41.9,40.01 41.71,39.81
  Top 2.184: 14.95,16.7 10.95,16.7 C2.2
  Top 3.048: ZD1.A 56.06,21.18 52.86,24.38 41.62,24.38 22.64,24.38 18.63,20.38 | VAR2.P$1 18.63,20.38 | 18.63,20.38 14.95,16.7 14.95,13.59 20.79,7.75 X1.2
  Bottom 3.048: X1.4 30.79,6.71 27.72,9.78 22.88,9.78 20.79,7.68 X1.2
DC_PREG1
  pour Top (isolate 0.305, no thermals): 41.75,78.11 43.08,78.11 43.08,76.96 44.8,75.25 44.8,72.39 40.03,72.39 40.03,75.82 41.75,75.82
ETH_ACTLED
  Top 0.254: X6.2 4.66,54.36 4.66,49.47 15.64,38.5 X5.YA
ETH_IN+  (via drill 0.6)
  Top 0.254: X5.6 8.11,29.6 v8.48,29.97 8.92,30.42 IC3.5
  Bottom 0.254: X6.4 5.43,48.51 5.43,38.99 8.03,36.39 8.03,30.35 v8.48,29.97
ETH_IN-  (via drill 0.6)
  Top 0.254: IC3.4 7.9,31.94 7.65,32.19 v7.01,32.19 6.39,32.19 X5.3
  Bottom 0.254: X6.5 2.7,48.77 4.86,46.61 4.86,38.73 7.46,36.13 7.46,32.64 v7.01,32.19
ETH_LINKLED  (1 unrouted)
  Top 0.254: X6.1 2.63,58.23 5.43,55.44 5.43,50.1 16.92,38.61 16.92,29.02 15.65,27.75
ETH_OUT+
  Top 0.254: IC3.3 7.9,34.61 7.84,34.67
  Top 0.305: 7.84,34.67 X5.2
  Top 0.406: X5.2 2.3,34.68 1.17,35.81 1.17,44.77 X6.6
ETH_OUT-
  Top 0.254: X5.1 7.83,35.95 8.92,34.86 IC3.1
  Top 0.406: X5.1 5.18,41.15 X6.7
FAN_CONTROL
  Top 0.305: R14.2 16.6,86.93 16.6,91.89 19.52,94.81 23.61,94.81 X2.4
FAN_OUT  (3 unrouted)
  Top 0.305: 11.71,80.14 9.75,80.14 9.43,79.82
  Top 0.61: L4.2 9.45,83.27 D2.A
  Top 0.813: 11.71,80.14 C15.2 | 9.43,79.76 9.43,75.69 10.82,74.3 Q3.2 Q3.4
  pour Top (isolate 0.305, no thermals): 19.65,76.77 19.65,65.34 7.14,65.34 7.14,76.77
FAN_SENSE
  Top 0.305: 14.32,91.12 X4.3 14.32,96.65 15.14,97.47 23.48,97.47 X2.3 | 14.32,91.12 R17.2 | R18.1 14.31,91.12 14.32,91.12
GND  (via drill 0.6)
  Top 0.254: v36.67,74.8 37.62,74.8 C4.2 | v40.48,68.58 R8.1 | IC3.2 8.41,33.34 v8.98,32.77
  Top 0.305: v17.56,87.31 18.25,87.31 C10.2 | C8.1 v38.19,79.95 | v17.49,83.82 18.32,83.82 C9.2 | R18.2 v13.11,88.14
  Top 0.406: R15.1 R16.1 13.75,79.12 v13.68,79.12 | v13.37,71.94 11.85,71.94 Q3.3
  Top 0.813: B1.- 57.83,85.33 C5.-
  other vias: 17.56,88.27 17.49,84.77 41.56,81.97 41.56,80.96 41.56,79.96 36.67,73.85 45.5,82.09 45.5,81.15 51.91,96.2 46.83,96.2 46.83,95.19 46.83,94.17 51.91,95.19 51.91,94.17 10.25,71.95 51.91,93.15 46.83,93.15
  pour Top (isolate 0.305, no thermals): 40.61,83.19 45.94,83.19 45.94,84.45 51.4,84.45 51.4,77.28 46.83,77.28 46.83,78.74 40.61,78.74
  pour Bottom (isolate 0.305, rank 2): -0.61,100.65 74.64,100.65 74.64,78.11 54.32,78.11 52.73,76.52 52.73,69.22 49.88,66.36 19.4,66.36 17.49,64.45 17.49,24.45 15.9,22.86 -0.61,22.86
  pour Top (isolate 0.305, no thermals): 28.22,100.58 68.42,100.58 68.42,92.77 28.22,92.77
IS
  Top 0.356: IC1.13 43.2,84.89 43.4,85.09
  pour Top (isolate 0.305, no thermals): 43.15,84.07 43.15,86.8 42.51,87.44 42.51,91.63 47.21,91.63 47.21,87.06 44.16,87.06 44.16,85.03 43.4,85.03 43.27,84.9 43.27,84.07
N$1
  Top 0.406: C6.2 R9.2
N$2  (via drill 0.6)
  Top 0.61: OK1.6 v71.47,68.39
  Bottom 0.813: Q2.G 67.21,51.5 68.86,53.15 68.86,65.79 v71.47,68.39
N$3  (1 unrouted)
  Top 0.508: 66.32,69.71 OK1.4
  Top 0.61: R3.1 66.38,69.67 66.32,69.72
N$4  (via drill 0.6)
  Top 0.61: OK2.4 56.48,69.03 53.75,66.29 v53.75,48.01
  Bottom 0.61: v53.75,48.01 53.75,43.37 56.55,40.58 Q1.G
N$5
  Top 0.254: OK1.2 68.93,80.83 R4.1
N$6
  Top 0.254: R6.1 60.48,81.35 59.02,79.88 OK2.2
N$7
  Top 0.61: R5.1 62.65,68.82 OK2.6
N$8
  Top 3.048: X1.3 25.79,6.96 28.22,9.4 63.91,9.4 67.59,13.08 R2.2
  Bottom 2.54: Q2.A2 68.23,46.04 71.66,42.61 71.66,18.73 R2.2
N$9  (via drill 0.7)
  Top 0.813: TR1.S2.1T 23.47,39.94 | 23.47,39.94 23.47,39.95 26.38,42.86 26.38,54.67 TR1.S1.1T | TR1.S2.1V 23.41,40.01 23.47,39.94 | v71.4,89.15 71.4,89.62 B1.AC1
  Bottom 0.813: TR1.S1.1V 21.13,55.24 TR1.S1.1T 23.47,62.62 27.02,66.17 45.5,66.17 49.81,70.48 49.81,76.58 54.45,81.22 64.67,81.22 71.4,87.95 v71.4,89.15
N$11  (via drill 0.6)
  Top 0.254: IC4.4 7.03,57.42 | C16.2 v6.7,53.97 v6.7,53.98
  Top 0.305: 7.06,57.42 7.06,57.07 X8.1
  Top 0.406: 7.03,57.42 7.06,57.42
  Bottom 0.254: X8.1 6,58.13 6,60.71 X7.1
  Bottom 0.305: v6.7,53.98 7.12,53.98 X8.1
N$12
  Top 0.406: C15.1 R16.2
N$13
  Top 0.254: IC1.4 43.2,76.91 45.56,74.55 45.56,72.26 45.11,71.82 42.19,71.82 41.69,71.31 41.69,68.2 41.05,67.56 37.5,67.56 33.24,71.82 X3.2
N$14
  Top 0.406: X7.5 5.62,74.23 R19.2
N$15
  Top 0.813: R1.1 66.78,29.22 C1.1
N$17
  Top 0.305: 15.71,84.2 R14.1 R15.2 16.86,82.1 17.43,81.53 17.43,79.12 15.97,77.66 12.91,77.66 Q3.1
N$18
  Top 0.254: X7.2 2.63,66.04 5.11,63.56 5.11,60.2 | IC4.2 5.1,60.19
  Top 0.406: IC4.2 5.11,59.89 5.11,60.2 5.11,60.64 5.55,61.09 8.16,61.09 8.77,60.48 8.77,58.12 X8.2
N$19
  Top 0.61: C14.1 9.81,87.44 D2.C
  Top 0.813: IC2.3 54.07,98.42 10.89,98.42 9.24,96.77 X4.1 9.24,94.55 11.02,92.77 D2.C
N$20  (via drill 0.7)
  Top 0.813: v71.4,84.14 71.4,84.52 B1.AC2
  Bottom 0.813: 26.26,52.58 26.26,62.67 27.97,64.39 46.45,64.39 52.35,70.29 52.35,76.58 55.15,79.38 66.64,79.38 v71.4,84.14 | TR1.S2.2V 21.13,34.92 TR1.S2.2T 26.26,35.37 26.26,52.58 | TR1.S1.2V 21.05,50.16 TR1.S1.2T 25.61,52.59 26.26,52.58
N$21  (via drill 0.6)
  Top 0.813: C14.2 3.4,87.44 | L4.1 2.55,86.59 3.4,87.44 | 3.4,87.44 3.4,88.65 v7.78,93.03
  Bottom 0.813: v7.78,93.03 10.63,93.03 11.78,94.17 X4.2
N$22
  Top 0.254: X7.3 3.52,69.15 4.66,68.01 4.66,65.6 11.84,58.42 X8.3
  Top 0.406: X8.3 11.16,57.99 10.38,57.21 10.38,55.24 9.43,54.29 8.09,54.29 5.1,57.29 IC4.3
N$23  (via drill 0.6)  (1 unrouted)
  Top 0.254: X7.4 3.46,71.69 5.3,69.85 5.3,65.79 11.4,59.69 12.6,59.69 13.49,58.8 13.49,57.15 X8.4
  Top 0.305: C16.1 9.3,52.96 X8.4
  Top 0.406: v7.78,60.07 7.01,60.07 IC4.1
  Bottom 0.406: v7.78,60.07 9.49,60.07 10.44,59.12 10.44,56.89 X8.4
N$25
  Top 0.813: R1.2 61.82,23.5 60.79,23.38 60.74,23.37
  Top 3.048: R2.1 62.51,21.65 60.79,23.38 | 60.74,23.37 52.73,31.37 52.73,42.42 56.35,46.04 Q1.A2
N$77
  Top 0.254: C12.2 47.72,72.33 R12.2
N$114
  Bottom 3.048: VAR1.P$1 29.86,15.37 | 29.86,15.37 VAR2.P$2 | 30.34,15.39 29.88,15.39 29.86,15.37
  Bottom 3.81: SAR1.P$1 30.34,15.39
N$125  (via drill 0.6)
  Top 0.305: L3.P$1 2.28,37 v2.25,36.39
  Bottom 0.305: X5.4 2.11,32.14 1.05,33.21 1.05,35.18 v2.25,36.39
N$128
  Top 0.254: IC1.6 44.49,77.14 45.43,76.2 R13.1 R10.2 49.62,74.36 C12.1 49.62,74.23 C13.1
N$131
  Top 0.356: C3.2 41.17,84.33 41.24,84.26 IC1.16
N$135  (1 unrouted)
  Top 0.254: IC1.5 43.86,77.01 46.19,74.68 46.19,71.06 46.7,70.55 | C13.2 R12.1 47.02,70.23 46.7,70.55
N$165
  Top 0.254: IC1.7 45.15,77.24 45.37,77.03 46.19,77.03 46.45,77.28 46.45,79.5 46.7,79.76 48.99,79.76 49.56,80.33 R11.1
N$166  (1 unrouted)
  Top 0.356: IC1.1 41.06,78.12 41.05,78.11
  Top 0.406: 41.05,78.11 39.46,78.11 C8.2
N$167  (1 unrouted)
  Top 0.305: IC1.8 45.81,79.82 46.77,80.77 47.59,80.77 47.66,80.83
N$168
  Top 0.305: IC1.10 45.15,84.87 45.43,85.15 47.28,85.15 C7.1
N$180
  Top 0.254: IC1.2 41.88,78.12 | 41.88,78.12 41.88,78.17 | 41.88,78.12 41.88,76.9 41.43,76.45 39.59,76.45 39.27,76.14 39.27,72.77 38.58,72.08 R7.1 R8.2
PWR_DIRECT  (via drill 0.6)
  Top 0.254: R4.2 66.07,81.79 66.07,89.47 v66.58,89.85
  Bottom 0.254: v66.58,89.85 66.58,89.98 58.26,98.3 29.67,98.3 X2.1
PWR_SSTART  (via drill 0.6)
  Top 0.254: R6.2 63.66,81.41 64.23,81.41 65.18,82.36 65.18,88.52 v64.8,88.9
  Bottom 0.254: v64.8,88.9 64.8,90.11 57.62,97.16 31.06,97.16 X2.2
SW  (via drill 0.6)
  Top 0.305: IC1.14 42.56,85.23
  Top 0.356: IC1.15 41.9,85.62 41.94,85.66
  Top 0.813: L2.1 31.2,86.29
  other vias: 33.94,89.92 32.41,89.92 30.89,89.92 29.37,89.92 27.84,89.92 26.32,89.92 35.46,89.92
  pour Top (isolate 0.305, no thermals): 24.6,81.41 24.6,91.88 37.69,91.88 37.69,89.15 41.05,89.15 41.05,88.07 42.58,86.55 42.58,85.22 42.51,85.15 42.51,83.25 41.88,83.25 41.88,85.15 41.37,85.66 37.24,85.66 36.92,85.34 36.92,81.41
  pour Bottom (no thermals): 24.6,91.06 24.6,84.52 36.42,84.52 39.27,87.31 39.27,91.06
TA1  (via drill 3.2 pad 6)
  other vias: 4,96
TA2  (via drill 3.2 pad 6)
  other vias: 67,96
TA3  (via drill 3.2 pad 6)
  other vias: 4,4
TA4  (via drill 3.2 pad 6)
  other vias: 67,4
VIN  (1 unrouted)
  Top 0.813: L1.1 43.59,70.55 43.4,70.29 44.99,68.71 50.96,68.71 51.53,69.28 51.53,77.72 53.56,79.76 53.56,86.11 56.61,89.15 | IC2.1 55.05,90.68 C5.+ 57.85,90.43 B1.+

### Text on the board
Bottom: EEZ AUX PS (03/2016) r5B6a
tPlace: Fan | Out+ctrl | EEZ AUX PS | (03/2016) | r5B6a | +5V | Sync | Gnd | Nin Lin | Nout Lout Earth | CAUTION!
_tNames: R18 | C14 | X4 | R17 | C5 | R9 | IC2 | X2 | C6 | D1 | C10 | B1 | D2 | R14 | C3 | C7 | IC1 | C9 | L2 | R6 | R4 | C8 | R11 | R15 | OK2 | OK1 | C11 | C15 | R16 | R13 | X3 | C4 | R10 | L4 | C12 | R7 | R19 | R8 | R12 | C13 | Q3 | X7 | L1 | R5 | R3 | TR1 | IC4 | X8 | KK1 | Q1 | X6 | C16 | Q2 | L3 | IC3 | X5 | R1 | C1 | SAR1 | R2 | VAR2 | ZD2 | ZD1 | VAR1 | C2 | X1